# EAGLE schematic DLT_Jetson_Nano (EAGLE 9.4.2)
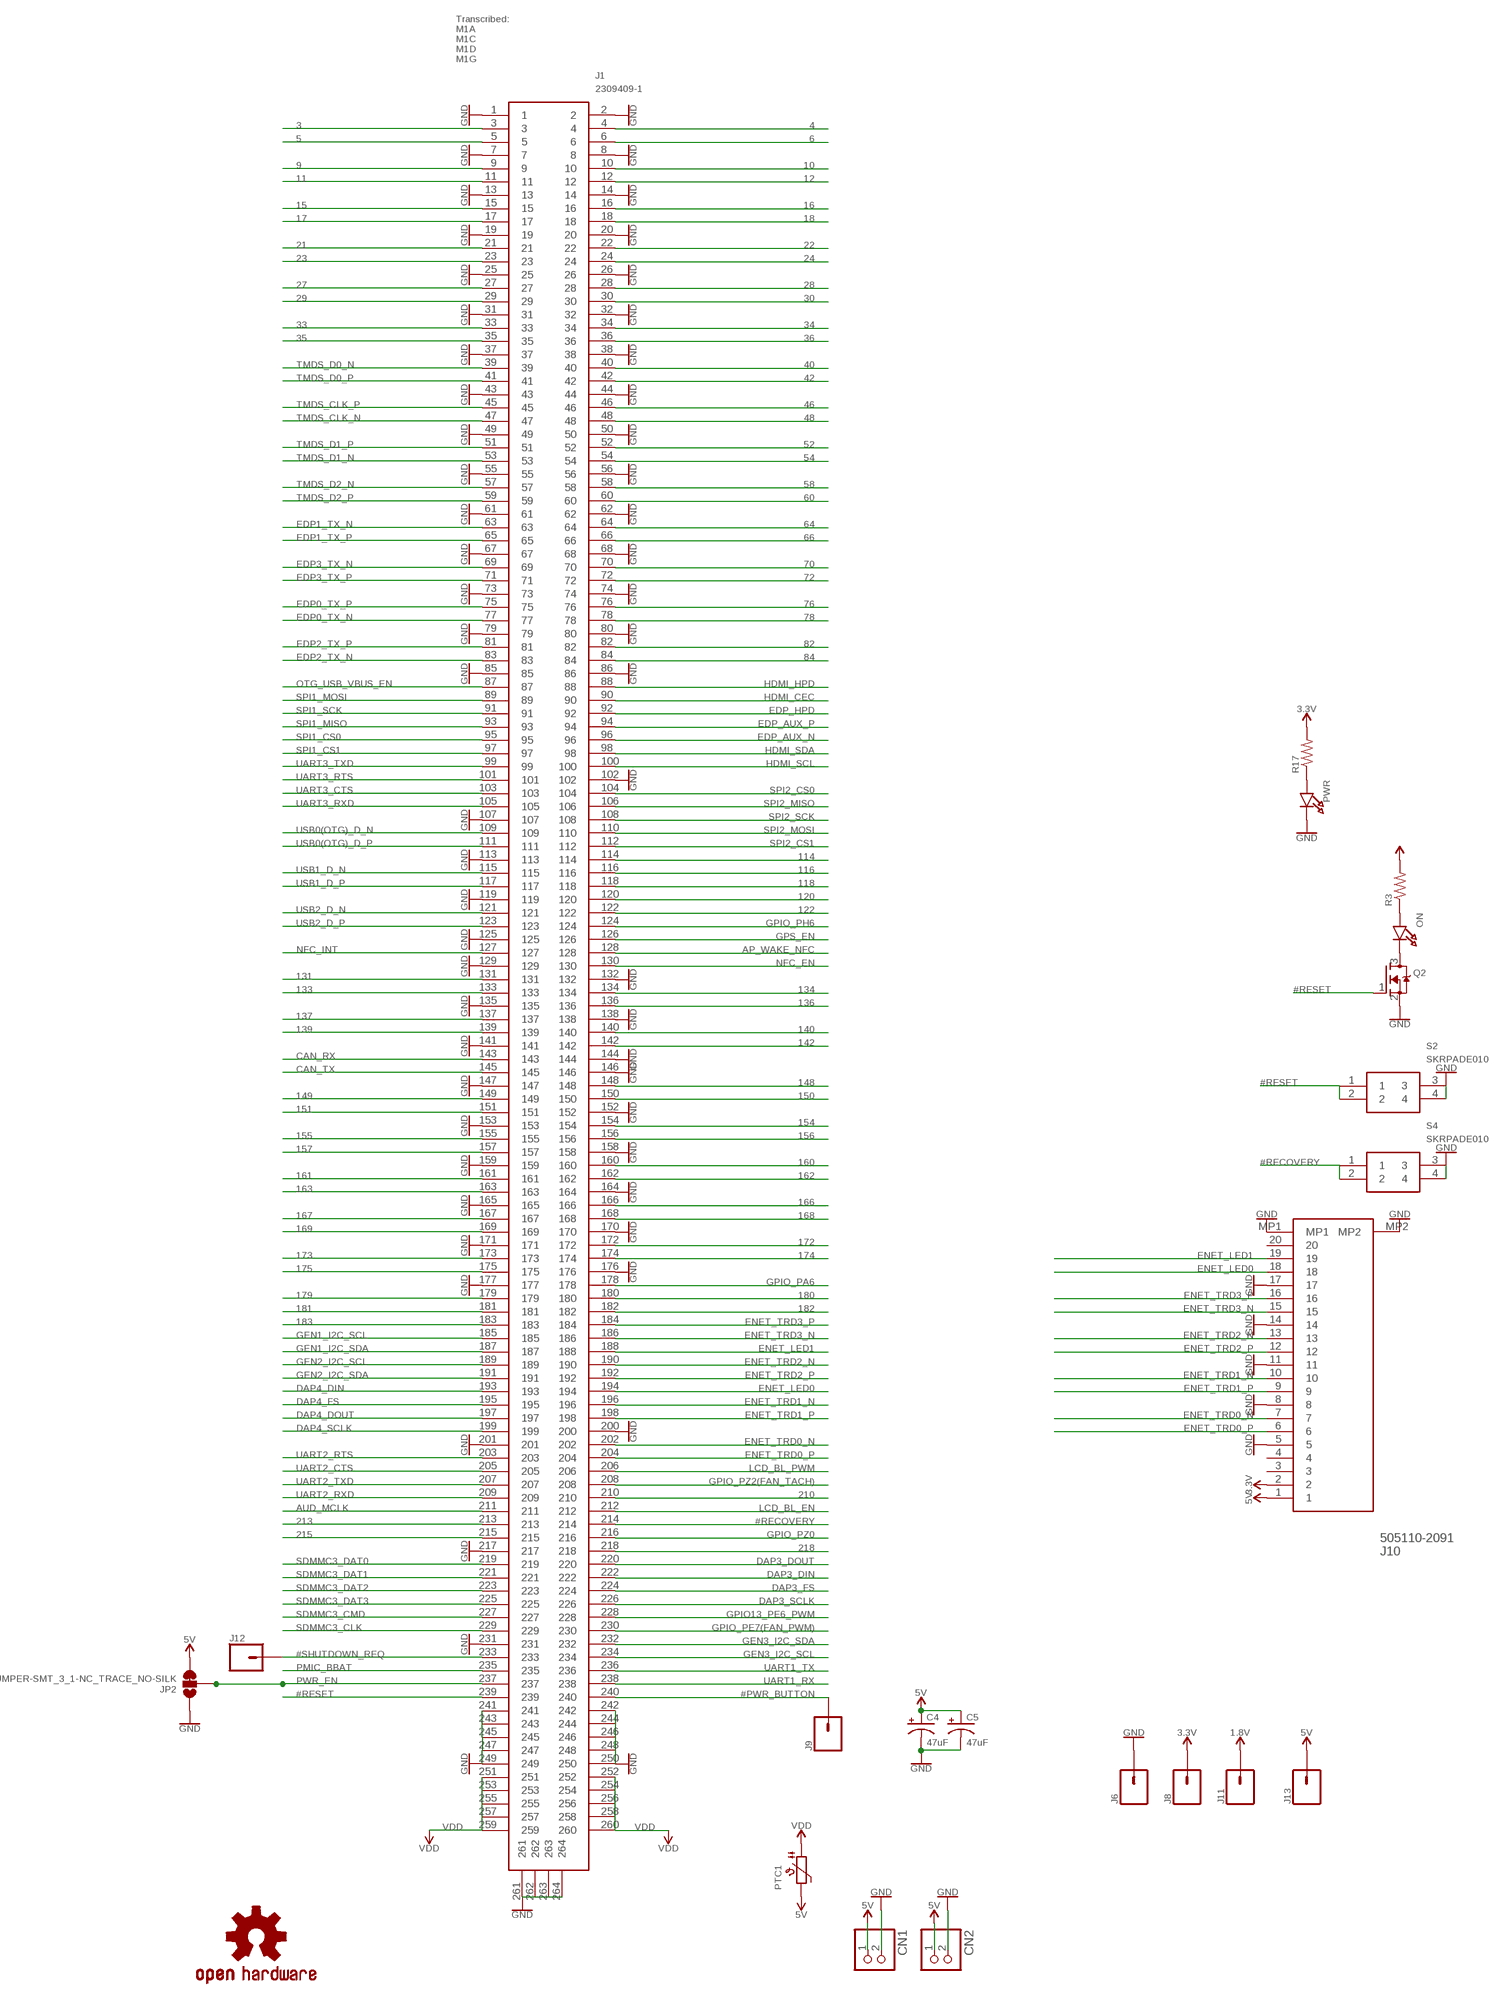
[diagram p0: schematic, sheet 1, part 1 of 2]
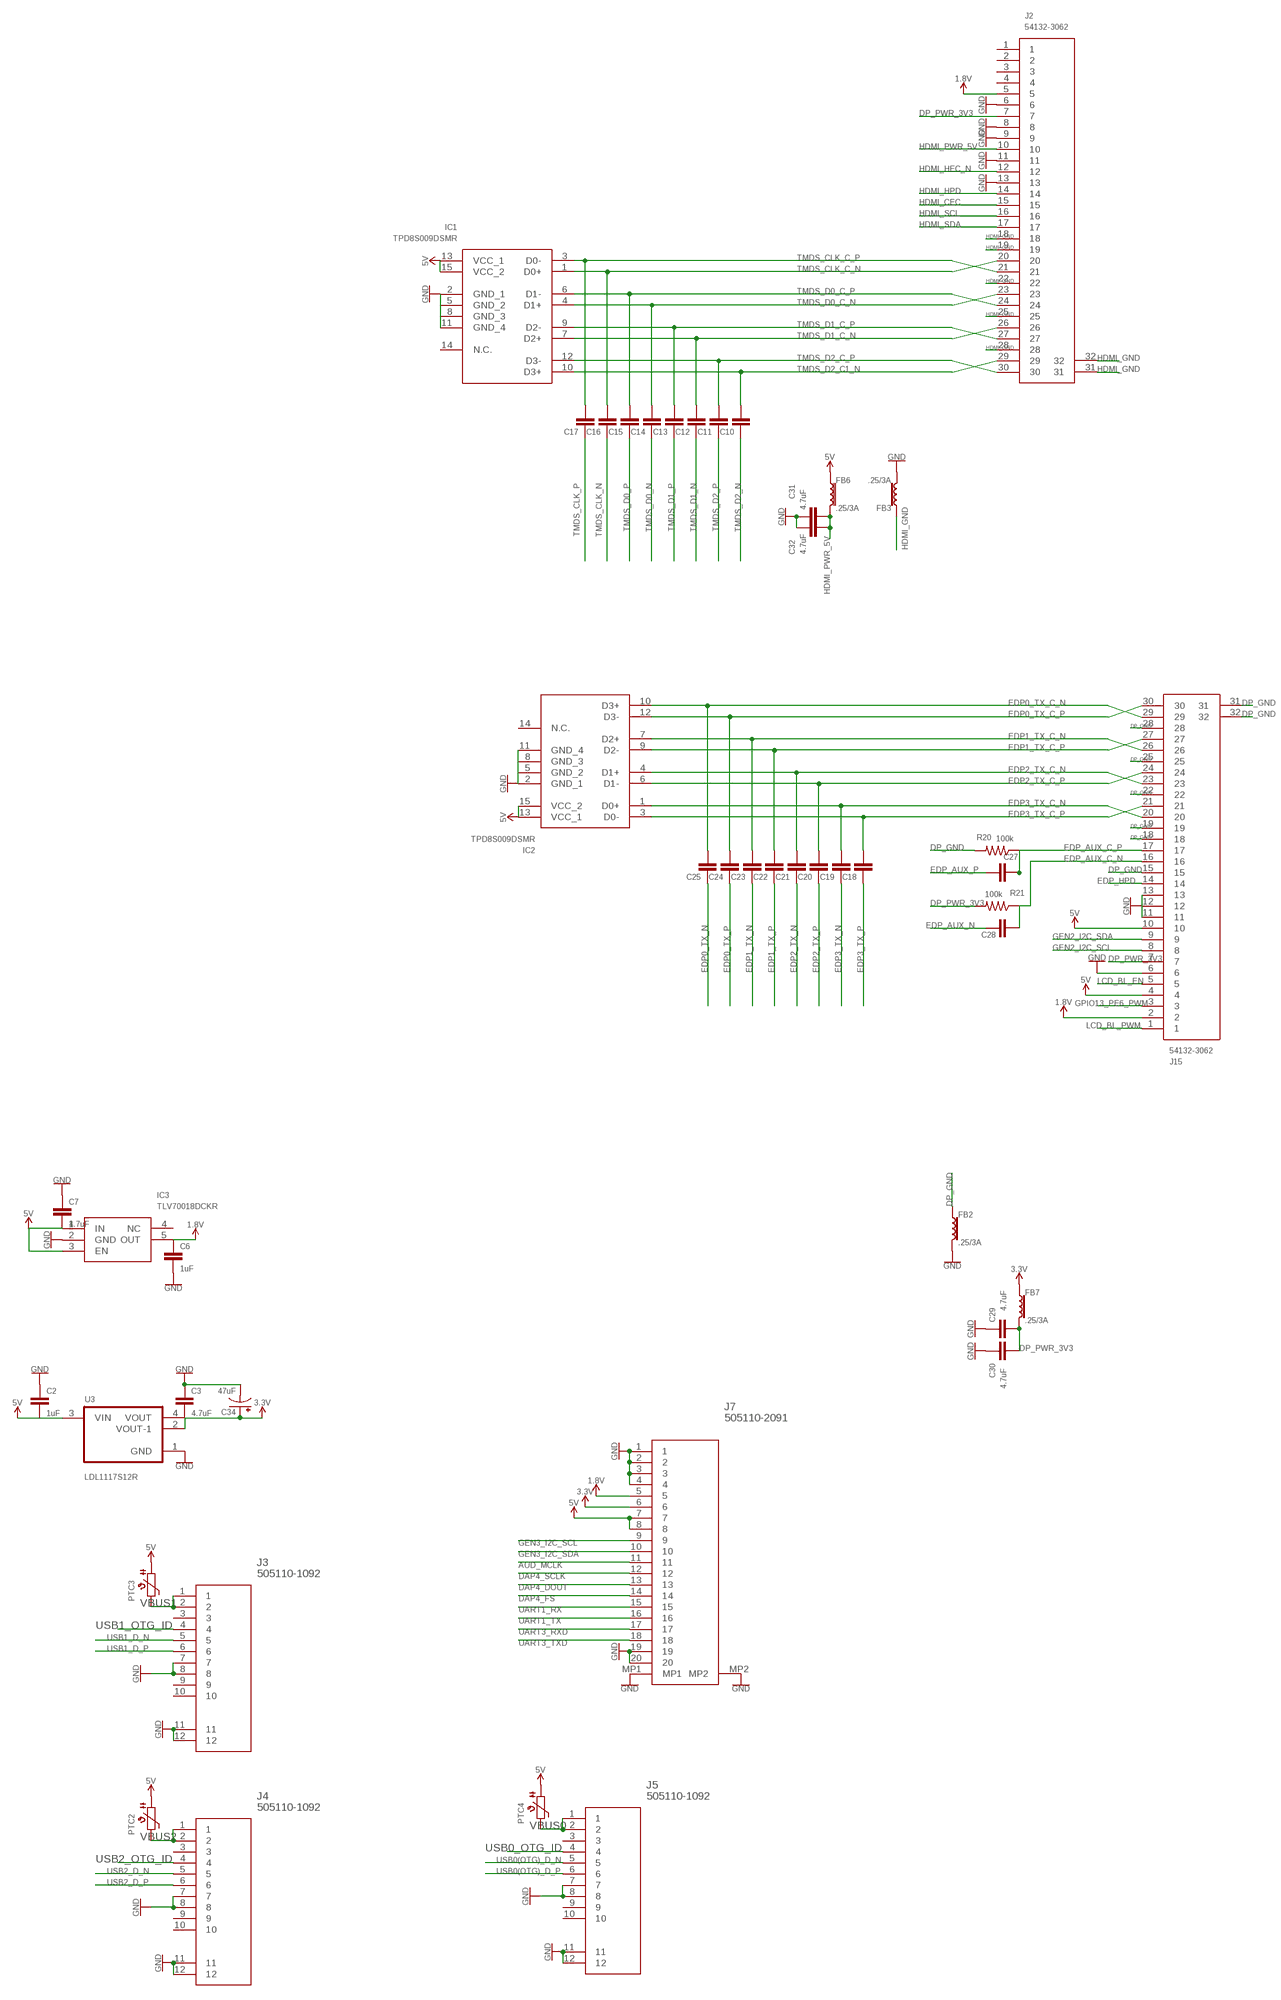
[diagram p1: schematic, sheet 1, part 2 of 2]

## Parts
C2  1uF  10NF-0603-50V-10%  [0603]
C3  4.7uF  10NF-0603-50V-10%  [0603]
C4  47uF  47UF-POLAR-EIA3528-10V-10%  [EIA3528]
C5  47uF  47UF-POLAR-EIA3528-10V-10%  [EIA3528]
C6  1uF  10NF-0603-50V-10%  [0603]
C7  4.7uF  10NF-0603-50V-10%  [0603]
C10  0.1uF  0.1UF-0402-16V-10%  [0402]
C11  0.1uF  0.1UF-0402-16V-10%  [0402]
C12  0.1uF  0.1UF-0402-16V-10%  [0402]
C13  0.1uF  0.1UF-0402-16V-10%  [0402]
C14  0.1uF  0.1UF-0402-16V-10%  [0402]
C15  0.1uF  0.1UF-0402-16V-10%  [0402]
C16  0.1uF  0.1UF-0402-16V-10%  [0402]
C17  0.1uF  0.1UF-0402-16V-10%  [0402]
C18  0.1uF  0.1UF-0402-16V-10%  [0402]
C19  0.1uF  0.1UF-0402-16V-10%  [0402]
C20  0.1uF  0.1UF-0402-16V-10%  [0402]
C21  0.1uF  0.1UF-0402-16V-10%  [0402]
C22  0.1uF  0.1UF-0402-16V-10%  [0402]
C23  0.1uF  0.1UF-0402-16V-10%  [0402]
C24  0.1uF  0.1UF-0402-16V-10%  [0402]
C25  0.1uF  0.1UF-0402-16V-10%  [0402]
C27  0.1uF  0.1UF-0402-16V-10%  [0402]
C28  0.1uF  0.1UF-0402-16V-10%  [0402]
C29  4.7uF  10NF-0603-50V-10%  [0603]
C30  4.7uF  10NF-0603-50V-10%  [0603]
C31  4.7uF  10NF-0603-50V-10%  [0603]
C32  4.7uF  10NF-0603-50V-10%  [0603]
C34  47uF  47UF-POLAR-EIA3528-10V-10%  [EIA3528]
CN1  JST_2PIN-SMT-RA  [JST-PH-2-SMT-RA]
CN2  JST_2PIN-SMT-RA  [JST-PH-2-SMT-RA]
FB2  .25/3A  FERRITE_BEAD-0603  [0603]
FB3  .25/3A  FERRITE_BEAD-0603  [0603]
FB6  .25/3A  FERRITE_BEAD-0603  [0603]
FB7  .25/3A  FERRITE_BEAD-0603  [0603]
IC1  TPD8S009DSMR  [TPD8S009DSMR]
IC2  TPD8S009DSMR  [TPD8S009DSMR]
IC3  TLV70018DCKR  [SOT65P210X110-5N]
J1  2309409-1  [2309409-1]
J2  54132-3062  [54132-3062]
J3  505110-1092  [5051101092]
J4  505110-1092  [5051101092]
J5  505110-1092  [5051101092]
J6  CONN_01  [1X01]
J7  505110-2091  [5051102091]
J8  CONN_01  [1X01]
J9  CONN_01  [1X01]
J10  505110-2091  [5051102091]
J11  CONN_01  [1X01]
J12  CONN_01  [1X01]
J13  CONN_01  [1X01]
J15  54132-3062  [54132-3062]
JP2  JUMPER-SMT_3_1-NC_TRACE_NO-SILK  [SMT-JUMPER_3_1-NC_TRACE_NO-SILK]
LOGO1  OSHW-LOGOS-COPPER  [OSHW-LOGO-S_COPPER]
ON  LED0805  [CHIPLED_0805]
PTC1  PTC1206  [1206]
PTC2  PTC1206  [1206]
PTC3  PTC1206  [1206]
PTC4  PTC1206  [1206]
PWR  LED0805  [CHIPLED_0805]
Q2  MOSFET-NWAVE  [SOT23-W]
R3  RESISTOR0805-RES  [0805]
R17  RESISTOR0805-RES  [0805]
R20  100k  RESISTOR0805-RES  [0805]
R21  100k  RESISTOR0805-RES  [0805]
S2  SKRPADE010  [SKRPADE010]
S4  SKRPADE010  [SKRPADE010]
U3  LDL1117S12R  [SOT230P700X180-4N]

## Nets
1.8V: C6.1 IC3.5(OUT) J2.5 J7.5 J11.1 J15.2
3: J1.3
3.3V: C3.2 C34.A(+) FB7.1 J7.6 J8.1 J10.2 R17.2 U3.2(VOUT-1) U3.4(VOUT)
4: J1.4
5: J1.5
5V: C2.2 C4.A(+) C5.A(+) C7.2 CN1.1 CN2.1 FB6.1 IC1.13(VCC_1) IC1.15(VCC_2) IC2.13(VCC_1) IC2.15(VCC_2) IC3.1(IN) IC3.3(EN) J7.7 J7.8 J10.1 J13.1 J15.4 J15.10 JP2.3 PTC1.2 PTC2.1 PTC3.1 PTC4.1 R3.2 U3.3(VIN)
6: J1.6
9: J1.9
10: J1.10
11: J1.11
12: J1.12
15: J1.15
16: J1.16
17: J1.17
18: J1.18
21: J1.21
22: J1.22
23: J1.23
24: J1.24
27: J1.27
28: J1.28
29: J1.29
30: J1.30
33: J1.33
34: J1.34
35: J1.35
36: J1.36
40: J1.40
42: J1.42
46: J1.46
48: J1.48
52: J1.52
54: J1.54
58: J1.58
60: J1.60
64: J1.64
66: J1.66
70: J1.70
72: J1.72
76: J1.76
78: J1.78
82: J1.82
84: J1.84
114: J1.114
116: J1.116
118: J1.118
120: J1.120
122: J1.122
131: J1.131
133: J1.133
134: J1.134
136: J1.136
137: J1.137
139: J1.139
140: J1.140
142: J1.142
148: J1.148
149: J1.149
150: J1.150
151: J1.151
154: J1.154
155: J1.155
156: J1.156
157: J1.157
160: J1.160
161: J1.161
162: J1.162
163: J1.163
166: J1.166
167: J1.167
168: J1.168
169: J1.169
172: J1.172
173: J1.173
174: J1.174
175: J1.175
179: J1.179
180: J1.180
181: J1.181
182: J1.182
183: J1.183
210: J1.210
213: J1.213
215: J1.215
218: J1.218
#PWR_BUTTON: J1.240 J9.1
#RECOVERY: J1.214 S4.1 S4.2
#RESET: J1.239 Q2.1(G) S2.1 S2.2
#SHUTDOWN_REQ: J1.233 J12.1
AP_WAKE_NFC: J1.128
AUD_MCLK: J1.211 J7.11
CAN_RX: J1.143
CAN_TX: J1.145
DAP3_DIN: J1.222
DAP3_DOUT: J1.220
DAP3_FS: J1.224
DAP3_SCLK: J1.226
DAP4_DIN: J1.193
DAP4_DOUT: J1.197 J7.13
DAP4_FS: J1.195 J7.14
DAP4_SCLK: J1.199 J7.12
DP_GND: FB2.1 J15.15 J15.18 J15.19 J15.22 J15.25 J15.28 J15.31 J15.32 R20.2
DP_PWR_3V3: C29.2 C30.2 FB7.2 J2.7 J15.7 R21.2
EDP0_TX_C_N: C25.2 IC2.10(D3+) J15.29
EDP0_TX_C_P: C24.2 IC2.12(D3-) J15.30
EDP0_TX_N: C25.1 J1.77
EDP0_TX_P: C24.1 J1.75
EDP1_TX_C_N: C23.2 IC2.7(D2+) J15.26
EDP1_TX_C_P: C22.2 IC2.9(D2-) J15.27
EDP1_TX_N: C23.1 J1.63
EDP1_TX_P: C22.1 J1.65
EDP2_TX_C_N: C21.2 IC2.4(D1+) J15.23
EDP2_TX_C_P: C20.2 IC2.6(D1-) J15.24
EDP2_TX_N: C21.1 J1.83
EDP2_TX_P: C20.1 J1.81
EDP3_TX_C_N: C19.2 IC2.1(D0+) J15.20
EDP3_TX_C_P: C18.2 IC2.3(D0-) J15.21
EDP3_TX_N: C19.1 J1.69
EDP3_TX_P: C18.1 J1.71
EDP_AUX_C_N: C28.1 J15.16 R21.1
EDP_AUX_C_P: C27.1 J15.17 R20.1
EDP_AUX_N: C28.2 J1.96
EDP_AUX_P: C27.2 J1.94
EDP_HPD: J1.92 J15.14
ENET_LED0: J1.194 J10.18
ENET_LED1: J1.188 J10.19
ENET_TRD0_N: J1.202 J10.7
ENET_TRD0_P: J1.204 J10.6
ENET_TRD1_N: J1.196 J10.10
ENET_TRD1_P: J1.198 J10.9
ENET_TRD2_N: J1.190 J10.13
ENET_TRD2_P: J1.192 J10.12
ENET_TRD3_N: J1.186 J10.15
ENET_TRD3_P: J1.184 J10.16
GEN1_I2C_SCL: J1.185
GEN1_I2C_SDA: J1.187
GEN2_I2C_SCL: J1.189 J15.8
GEN2_I2C_SDA: J1.191 J15.9
GEN3_I2C_SCL: J1.234 J7.9
GEN3_I2C_SDA: J1.232 J7.10
GND: C2.1 C3.1 C4.C(-) C5.C(-) C6.2 C7.1 C29.1 C30.1 C31.1 C32.1 C34.C(-) CN1.2 CN2.2 FB2.2 FB3.2 IC1.2(GND_1) IC1.5(GND_2) IC1.8(GND_3) IC1.11(GND_4) IC2.2(GND_1) IC2.5(GND_2) IC2.8(GND_3) IC2.11(GND_4) IC3.2(GND) J1.1 J1.2 J1.7 J1.8 J1.13 J1.14 J1.19 J1.20 J1.25 J1.26 J1.31 J1.32 J1.37 J1.38 J1.43 J1.44 J1.49 J1.50 J1.55 J1.56 J1.61 J1.62 J1.67 J1.68 J1.73 J1.74 J1.79 J1.80 J1.85 J1.86 J1.102 J1.107 J1.113 J1.119 J1.125 J1.129 J1.132 J1.135 J1.138 J1.141 J1.144 J1.146 J1.147 J1.152 J1.153 J1.158 J1.159 J1.164 J1.165 J1.170 J1.171 J1.176 J1.177 J1.200 J1.201 J1.217 J1.231 J1.241 J1.242 J1.243 J1.244 J1.245 J1.246 J1.247 J1.248 J1.249 J1.250 J1.261 J1.262 J1.263 J1.264 J2.6 J2.8 J2.9 J2.11 J2.13 J3.7 J3.8 J3.11 J3.12 J4.7 J4.8 J4.11 J4.12 J5.7 J5.8 J5.11 J5.12 J6.1 J7.1 J7.2 J7.3 J7.4 J7.19 J7.20 J7.MP1 J7.MP2 J10.5 J10.8 J10.11 J10.14 J10.17 J10.MP1 J10.MP2 J15.6 J15.11 J15.12 J15.13 JP2.1 PWR.C Q2.2(S) S2.3 S2.4 S4.3 S4.4 U3.1(GND)
GPIO13_PE6_PWM: J1.228 J15.3
GPIO_PA6: J1.178
GPIO_PE7(FAN_PWM): J1.230
GPIO_PH6: J1.124
GPIO_PZ0: J1.216
GPIO_PZ2(FAN_TACH): J1.208
GPS_EN: J1.126
HDMI_CEC: J1.90 J2.15
HDMI_GND: FB3.1 J2.18 J2.19 J2.22 J2.25 J2.28 J2.31 J2.32
HDMI_HEC_N: J2.12
HDMI_HPD: J1.88 J2.14
HDMI_PWR_5V: C31.2 C32.2 FB6.2 J2.10
HDMI_SCL: J1.100 J2.16
HDMI_SDA: J1.98 J2.17
LCD_BL_EN: J1.212 J15.5
LCD_BL_PWM: J1.206 J15.1
N$6: ON.C Q2.3(D)
N$9: ON.A R3.1
N$14: PWR.A R17.1
NFC_EN: J1.130
NFC_INT: J1.127
OTG_USB_VBUS_EN: J1.87
PMIC_BBAT: J1.235
PWR_EN: J1.237 JP2.2
SDMMC3_CLK: J1.229
SDMMC3_CMD: J1.227
SDMMC3_DAT0: J1.219
SDMMC3_DAT1: J1.221
SDMMC3_DAT2: J1.223
SDMMC3_DAT3: J1.225
SPI1_CS0: J1.95
SPI1_CS1: J1.97
SPI1_MISO: J1.93
SPI1_MOSI: J1.89
SPI1_SCK: J1.91
SPI2_CS0: J1.104
SPI2_CS1: J1.112
SPI2_MISO: J1.106
SPI2_MOSI: J1.110
SPI2_SCK: J1.108
TMDS_CLK_C_N: C16.2 IC1.1(D0+) J2.20
TMDS_CLK_C_P: C17.2 IC1.3(D0-) J2.21
TMDS_CLK_N: C16.1 J1.47
TMDS_CLK_P: C17.1 J1.45
TMDS_D0_C_N: C14.2 IC1.4(D1+) J2.23
TMDS_D0_C_P: C15.2 IC1.6(D1-) J2.24
TMDS_D0_N: C14.1 J1.39
TMDS_D0_P: C15.1 J1.41
TMDS_D1_C_N: C12.2 IC1.7(D2+) J2.26
TMDS_D1_C_P: C13.2 IC1.9(D2-) J2.27
TMDS_D1_N: C12.1 J1.53
TMDS_D1_P: C13.1 J1.51
TMDS_D2_C1_N: C10.2 IC1.10(D3+) J2.29
TMDS_D2_C_P: C11.2 IC1.12(D3-) J2.30
TMDS_D2_N: C10.1 J1.57
TMDS_D2_P: C11.1 J1.59
UART1_RX: J1.238 J7.15
UART1_TX: J1.236 J7.16
UART2_CTS: J1.205
UART2_RTS: J1.203
UART2_RXD: J1.209
UART2_TXD: J1.207
UART3_CTS: J1.103
UART3_RTS: J1.101
UART3_RXD: J1.105 J7.17
UART3_TXD: J1.99 J7.18
USB0(OTG)_D_N: J1.109 J5.5
USB0(OTG)_D_P: J1.111 J5.6
USB0_OTG_ID: J5.4
USB1_D_N: J1.115 J3.5
USB1_D_P: J1.117 J3.6
USB1_OTG_ID: J3.4
USB2_D_N: J1.121 J4.5
USB2_D_P: J1.123 J4.6
USB2_OTG_ID: J4.4
VBUS0: J5.1 J5.2 PTC4.2
VBUS1: J3.1 J3.2 PTC3.2
VBUS2: J4.1 J4.2 PTC2.2
VDD: J1.251 J1.252 J1.253 J1.254 J1.255 J1.256 J1.257 J1.258 J1.259 J1.260 PTC1.1
Unconnected: IC1.14(N.C.) IC2.14(N.C.) IC3.4(NC) J2.1 J2.2 J2.3 J2.4 J3.3 J3.9 J3.10 J4.3 J4.9 J4.10 J5.3 J5.9 J5.10 J10.3 J10.4 J10.20

## Notes on the sheet
- Transcribed:
  M1A
  M1C
  M1D
  M1G

## Library data of the parts
C2 C3 C6 C7 C29-C32 = SparkFun-Capacitors:10NF: 0.01uF/10nF/10,000pF ceramic capacitors A capacitor is a passive two-terminal electrical component used to store electrical energy temporarily in an electric field. CAP-09321; PROD_ID: CAP-00867; VALUE: 10nF
C4 C5 C34 = SparkFun-Capacitors:47UF-POLAR: 47µF polarized capacitors A capacitor is a passive two-terminal electrical component used to store electrical energy temporarily in an electric field.; PROD_ID: CAP-08310
C10-C25 C27 C28 = SparkFun-Capacitors:0.1UF: 0.1µF ceramic capacitors A capacitor is a passive two-terminal electrical component used to store electrical energy temporarily in an electric field.; PROD_ID: CAP-12416
CN1 CN2 = adafruit:JST_2PIN: JST 2-Pin Connectors of various flavors SMT-RA (S2B-PH-SM4) 4UConnector #17311 SMT (B2B-PH-SM4) THM-RA (S2B-PH) THM (B2B-PH)
FB2 FB3 FB6 FB7 = SparkFun-Coils:FERRITE_BEAD: Ferrite Bead (blocks, cores, rings, chokes, etc.) Inductor with layers of ferrite used to suppress high frequencies. Often used to isolate high frequency noise. SparkFun Products: IOIO-OTG - V2.2 <https://www.sparkfun.com/products/13613> SparkFun SAMD21 Mini Breakout <https://www.sparkfun.com/products/13664> SparkFun 6 Degrees of Freedom Breakout - LSM6DS3 <https://www.sparkfun.com/products/13339> SparkFun SAMD21 Dev Breakout <https://www.sparkfun.com/products/13672>; PROD_ID: NDUC-13805; VALUE: 30Ω/1.8A
IC1 IC2 = SamacSys_Parts:TPD8S009DSMR: 8-Channel ESD Solution for HDMI/DisplayPort Source: Datasheet <http://www.ti.com/lit/ds/symlink/tpd8s009.pdf>; DESCRIPTION: 8-Channel ESD Solution for HDMI/DisplayPort; HEIGHT: 0mm; MANUFACTURER_NAME: Texas Instruments; MANUFACTURER_PART_NUMBER: TPD8S009DSMR; MOUSER_PART_NUMBER: 595-TPD8S009DSMR; MOUSER_PRICE-STOCK: https://www.mouser.com/Search/Refine.aspx?Keyword=595-TPD8S009DSMR
IC3 = SamacSys_Parts:TLV70018DCKR: 200-mA, Low-IQ, Low-Dropout Regulator for Portable Devices Source: Datasheet <http://www.ti.com/lit/gpn/tlv700>; DESCRIPTION: 200-mA, Low-IQ, Low-Dropout Regulator for Portable Devices; HEIGHT: mm; MANUFACTURER_NAME: Texas Instruments; MANUFACTURER_PART_NUMBER: TLV70018DCKR; MOUSER_PART_NUMBER: 595-TLV70018DCKR; MOUSER_PRICE-STOCK: https://www.mouser.com/Search/Refine.aspx?Keyword=595-TLV70018DCKR
J1 = SamacSys_Parts:2309409-1: TE CONNECTIVITY - 2309409-1 - CONN, DDR4 SODIMM SOCKET, 260POS, 0.5MM Source: Datasheet <https://componentsearchengine.com/Datasheets/1/2309409-1.pdf>; DESCRIPTION: TE CONNECTIVITY - 2309409-1 - CONN, DDR4 SODIMM SOCKET, 260POS, 0.5MM; HEIGHT: mm; MANUFACTURER_NAME: TE Connectivity; MANUFACTURER_PART_NUMBER: 2309409-1; MOUSER_PART_NUMBER: 571-2309409-1; MOUSER_PRICE-STOCK: https://www.mouser.com/Search/Refine.aspx?Keyword=571-2309409-1
J2 J15 = 54132-3062:54132-3062: Connector 0.5mm, FFC/FPC, SMT,r/a,30w,Au Molex FFC/FPC SMT Series 0.5mm Pitch 30 Way Right Angle SMT Female FPC Connector, ZIF Bottom Contact Source: Datasheet <https://componentsearchengine.com/Datasheets/1/54132-3062.pdf>; DESCRIPTION: Connector 0.5mm, FFC/FPC, SMT,r/a,30w,Au Molex FFC/FPC SMT Series 0.5mm Pitch 30 Way Right Angle SMT Female FPC Connector, ZIF Bottom Contact; HEIGHT: mm; MANUFACTURER_NAME: Molex; MANUFACTURER_PART_NUMBER: 54132-3062; MOUSER_PART_NUMBER: 538-54132-3062; MOUSER_PRICE-STOCK: https://www.mouser.com/Search/Refine.aspx?Keyword=538-54132-3062
J3-J5 = SamacSys_Parts:505110-1092: Molex Easy-On Series 0.5mm Pitch 10 Way Right Angle SMT Male FPC Connector, ZIF Bottom Contact Source: Datasheet <https://componentsearchengine.com/Datasheets/1/505110-1092.pdf>; DESCRIPTION: Molex Easy-On Series 0.5mm Pitch 10 Way Right Angle SMT Male FPC Connector, ZIF Bottom Contact; HEIGHT: 0mm; MANUFACTURER_NAME: Molex; MANUFACTURER_PART_NUMBER: 505110-1092; MOUSER_PART_NUMBER: 538-505110-1092; MOUSER_PRICE-STOCK: https://www.mouser.com/Search/Refine.aspx?Keyword=538-505110-1092
J6 J8 J9 J11-J13 = SparkFun-Connectors:CONN_01: Single connection point. Often used as Generic Header-pin footprint for 0.1 inch spaced/style header connections On any of the 0.1 inch spaced packages, you can populate with these: Break Away Headers - Straight <https://www.sparkfun.com/products/116> (PRT-00116) Break Away Male Headers - Right Angle <https://www.sparkfun.com/products/553> (PRT-00553) Female Headers <https://www.sparkfun.com/products/115> (PRT-00115) Break Away Headers - Machine Pin <https://www.sparkfun.com/products/117> (PRT-00117) Break Away Female Headers - Swiss Machine Pin <https://www.sparkfun.com/products/743> (PRT-00743) This device is also useful as a general connection point to wire up your design to another part of your project. Our various solder wires solder well into these plated through hole pads. Hook-Up Wire - Assortment (Stranded, 22 AWG) <https://www.sparkfun.com/products/11375> (PRT-11375) Hook-Up Wire - Assortment (Solid Core, 22 AWG) <https://www.sparkfun.com/products/11367> (PRT-11367) View the entire wire category on our website here <https://www.sparkfun.com/categories/141> Special notes: SMTSO-256-ET is a "flush mount" nut for a 4-40 screw. We mostly use this on specialty testbeds; it is a nice way to connect hardware to your PCB at an adjustable hieght. Also note, the SNAP packages are for using a snappable style connector. We sell a baggie of snaps and they are also used on two LilyPad designs: Snap Assortment - 30 pack (male and female) <https://www.sparkfun.com/products/11347> (DEV-11347) LilyPad Arduino SimpleSnap <https://www.sparkfun.com/products/10941> (DEV-10941) LilyPad SimpleSnap Protoboard <https://www.sparkfun.com/products/10940> (DEV-10940)
J7 J10 = SamacSys_Parts:505110-2091: MOLEX - 505110-2091 - CONNECTOR, FFC/FPC, 20POS, 1ROW, 0.5MM Source: Datasheet <https://componentsearchengine.com/Datasheets/1/505110-2091.pdf>; DESCRIPTION: MOLEX - 505110-2091 - CONNECTOR, FFC/FPC, 20POS, 1ROW, 0.5MM; HEIGHT: 2.1mm; MANUFACTURER_NAME: Molex; MANUFACTURER_PART_NUMBER: 505110-2091; MOUSER_PART_NUMBER: 538-505110-2091; MOUSER_PRICE-STOCK: https://www.mouser.com/Search/Refine.aspx?Keyword=538-505110-2091
JP2 = SparkFun-Jumpers:JUMPER-SMT_3_1-NC_TRACE: Normally closed trace jumper (1 of 2 connections) This jumper has a trace between two pads so it's normally closed (NC). The other connection is normally open (NO). Use a razor knife to open the connection. For best results follow the IPC guidelines for cutting traces: Cutout at least 0.063 mm (0.005 in). Remove all loose material to clean up the cut area. Seal the cut with an approved epoxy. Reapply solder to reclose the connection, or to close the NO connection.
LOGO1 = SparkFun-Aesthetics:OSHW-LOGO: Open-Source Hardware (OSHW) Logo This logo indicates the piece of hardware it is found on incorporates a OSHW license and/or adheres to the definition of open source hardware found here: http://freedomdefined.org/OSHW
ON PWR = microbuilder:LED: LED 0603 - 0603 Surface Mount Package 2mA: Green LED - Low Power (3.9mcd, 2ma, 1.7Vf) - Digikey: 475-2709-2-ND Orange LED - Low Power (9.8mcd, 2ma, 1.8Vf) - Digikey: 475-1194-2-ND Red LED - Low Power (5mcd, 2ma, 1.8Vf) - Digikey: 475-1195-2-ND Yellow LED - Low Power (7mcd, 2ma, 1.8Vf) - Digikey: 475-1196-2-ND 5mA: Blue LED - Low Power (17mcd, 5ma, 2.9Vf) - Digikey: LNJ937W8CRACT-ND 0805 - 0805 Surface Mount Package 2mA: Red LED (8.8mcd, 2mA, 1.8Vf, Clear) - Low Power [Digikey: 475-2510-1-ND] Green LED (5mcd, 2mA, 1.8Vf, Clear) - Low Power [Digikey: 475-2730-1-ND] Yellow LED (11.3mcd, 2mA, 1.8Vf, Clear) - Low Power [Digikey: 475-2555-1-ND] 20mA: Red LED (104mcd, 20mA, Diffused) - LS R976 [Digikey: 475-1278-6-ND] Red LED (12mcd, 20mA, 2.0Vf, Clear) - APT2012EC [Digikey: 754-1128-1-ND] Green LED (15mcd, 20mA, 2.2Vf, Clear) - APT2012GC [Digikey: 754-1131-1-ND] Orange LED (160mcd, 20mA, 2.1Vf, Clear) - APT2012SECK [Digikey: 754-1130-1-ND] 1206 - 1206 Surface Mount Package Green LED (26mcd, 20mA, Diffused) - LG N971 [Digikey: 475-1407-6-ND] Red LED (15mcd, 20mA, Diffused) - LH N974 [Digikey: 475-1416-6-ND]
PTC1-PTC4 = microbuilder:PTC: PTC (Resettable Fuse) 1206 Package 250mA PTC (16V Max, Time-to-Trip: 0.08s) - Digikey: F2110CT-ND 1210 Package 100mA PTC (30V Max, Time-to-Trip: 0.6s) - Digikey: MF-USMF010-2CT-ND 1812 Package 750mA PTC (24V Max, Time-to-Trip: 0.2s) - Digikey: MF-MSMF075/24-2CT-ND
Q2 = microbuilder:MOSFET-N: N-Channel Mosfet LEGEND VDS: Voltage Drain-Source ID: Drain Current RDS(ON): Drain-Source On-State Resistance VGS(TH): Gate-Source Threshold Voltage CISS: Drain-Source Input Capacitance SOT-23 Name VDS ID RDS(ON) VGS(TH) CISS Order Number 2N7002E 60V 260mA 2.5 Ohm 2.5V @ 250uA 26.7pF @ 25V 2N7002ET1GOSTR-ND BSH103 30V 850mA 400 mOhm 400mV @ 1mA 83pF @ 24V BSH103,235-ND BSS138 60V 320mA 1.6 Ohm 1.5V @ 250uA 50pF @ 10V Mouser: 771-BSS138PW115 DMN2075U-7 20V 4.2A 38 mOhm 1V @ 250 uA 594.3pF @ 10V DMN2075U-7DICT-ND * BSS138 good choice for I2C level-shifting
R3 R17 R20 R21 = SparkFun-Passives:RESISTOR: Resistor Basic schematic elements and footprints for 0603, 1206, and PTH resistors.
S2 S4 = SamacSys_Parts:SKRPADE010: Tactile Switches 4.2x3.2x2.5mm 408gf Source: Datasheet <https://componentsearchengine.com/Datasheets/1/SKRPADE010.pdf>; DESCRIPTION: Tactile Switches 4.2x3.2x2.5mm 408gf; HEIGHT: 2mm; MANUFACTURER_NAME: ALPS; MANUFACTURER_PART_NUMBER: SKRPADE010; MOUSER_PART_NUMBER: 688-SKRPAD; MOUSER_PRICE-STOCK: https://www.mouser.com/Search/Refine.aspx?Keyword=688-SKRPAD
U3 = LDL1117S12R:LDL1117S12R: None; AVAILABILITY: Good; DESCRIPTION: 1.2 A High PSRR low dropout linear voltage regulator; MF: STMicroelectronics; MP: LDL1117S12R; PACKAGE: SOT-223 STMicroelectronics; PRICE: 0.22 USD